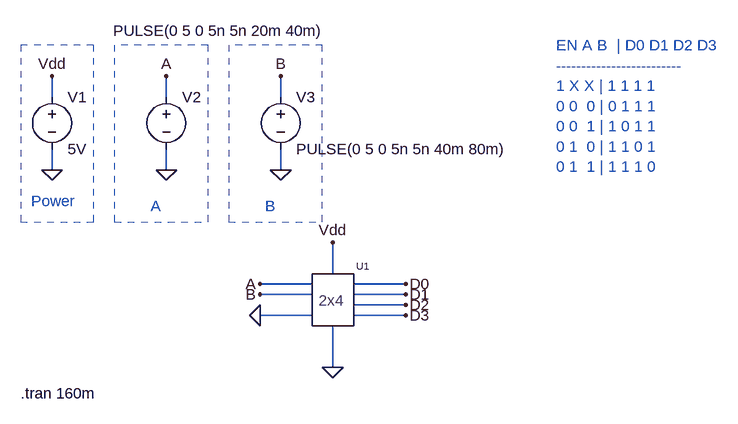
[diagram p0: schematic 2x4_block.asc]
2x4_block.asc, the LTspice schematic file:
Version 4
SHEET 1 880 680
WIRE -560 -416 -560 -448
WIRE -384 -416 -384 -448
WIRE -208 -416 -208 -448
WIRE -560 -304 -560 -336
WIRE -384 -304 -384 -336
WIRE -208 -304 -208 -336
WIRE -128 -144 -128 -192
WIRE -160 -128 -240 -128
WIRE -16 -128 -96 -128
WIRE -160 -112 -240 -112
WIRE -16 -112 -96 -112
WIRE -16 -96 -96 -96
WIRE -160 -80 -240 -80
WIRE -16 -80 -96 -80
WIRE -128 0 -128 -64
FLAG -240 -128 A
FLAG -128 -192 Vdd
FLAG -128 0 0
FLAG -560 -304 0
FLAG -560 -448 Vdd
FLAG -384 -304 0
FLAG -384 -448 A
FLAG -240 -112 B
FLAG -208 -304 0
FLAG -208 -448 B
FLAG -240 -80 0
FLAG -16 -128 D0
FLAG -16 -112 D1
FLAG -16 -96 D2
FLAG -16 -80 D3
SYMBOL voltage -560 -432 R0
WINDOW 123 0 0 Left 0
WINDOW 39 0 0 Left 0
SYMATTR InstName V1
SYMATTR Value 5V
SYMBOL voltage -384 -432 R0
WINDOW 123 0 0 Left 0
WINDOW 39 0 0 Left 0
WINDOW 3 -82 -86 Left 2
SYMATTR Value PULSE(0 5 0 5n 5n 20m 40m)
SYMATTR InstName V2
SYMBOL voltage -208 -432 R0
WINDOW 123 0 0 Left 0
WINDOW 39 0 0 Left 0
SYMATTR InstName V3
SYMATTR Value PULSE(0 5 0 5n 5n 40m 80m)
SYMBOL 2x4 -160 -64 R0
SYMATTR InstName U1
TEXT -592 -256 Left 2 ;Power
TEXT -408 -248 Left 2 ;A
TEXT -608 40 Left 2 !.tran 160m
TEXT -232 -248 Left 2 ;B
TEXT 216 -496 Left 2 ;EN A B  | D0 D1 D2 D3\n-------------------------\n1 X X | 1 1 1 1\n0 0  0 | 0 1 1 1\n0 0  1 | 1 0 1 1\n0 1  0 | 1 1 0 1\n0 1  1 | 1 1 1 0
RECTANGLE Normal -496 -496 -608 -224 2
RECTANGLE Normal -320 -496 -464 -224 2
RECTANGLE Normal -144 -496 -288 -224 2

The netlist it stands for:
* 2x4_block.asc
V1 Vdd 0 5V
V2 A 0 PULSE(0 5 0 5n 5n 20m 40m)
V3 B 0 PULSE(0 5 0 5n 5n 40m 80m)
XU1 A B 0 D0 D1 D2 D3 Vdd 0 2x4  ; pins A B EN D0 D1 D2 D3 Vdd Vss
* Power
* A
.tran 160m
* B
* EN A B  | D0 D1 D2 D3
* -------------------------
* 1 X X | 1 1 1 1
* 0 0  0 | 0 1 1 1
* 0 0  1 | 1 0 1 1
* 0 1  0 | 1 1 0 1
* 0 1  1 | 1 1 1 0
.backanno
.end